# Altium project WR_NIC.PrjPcb (part 5 of 6)

## Sheet 17-FPGA-02b.SchDoc
size B; SheetNumber: 17; SheetTotal: 22
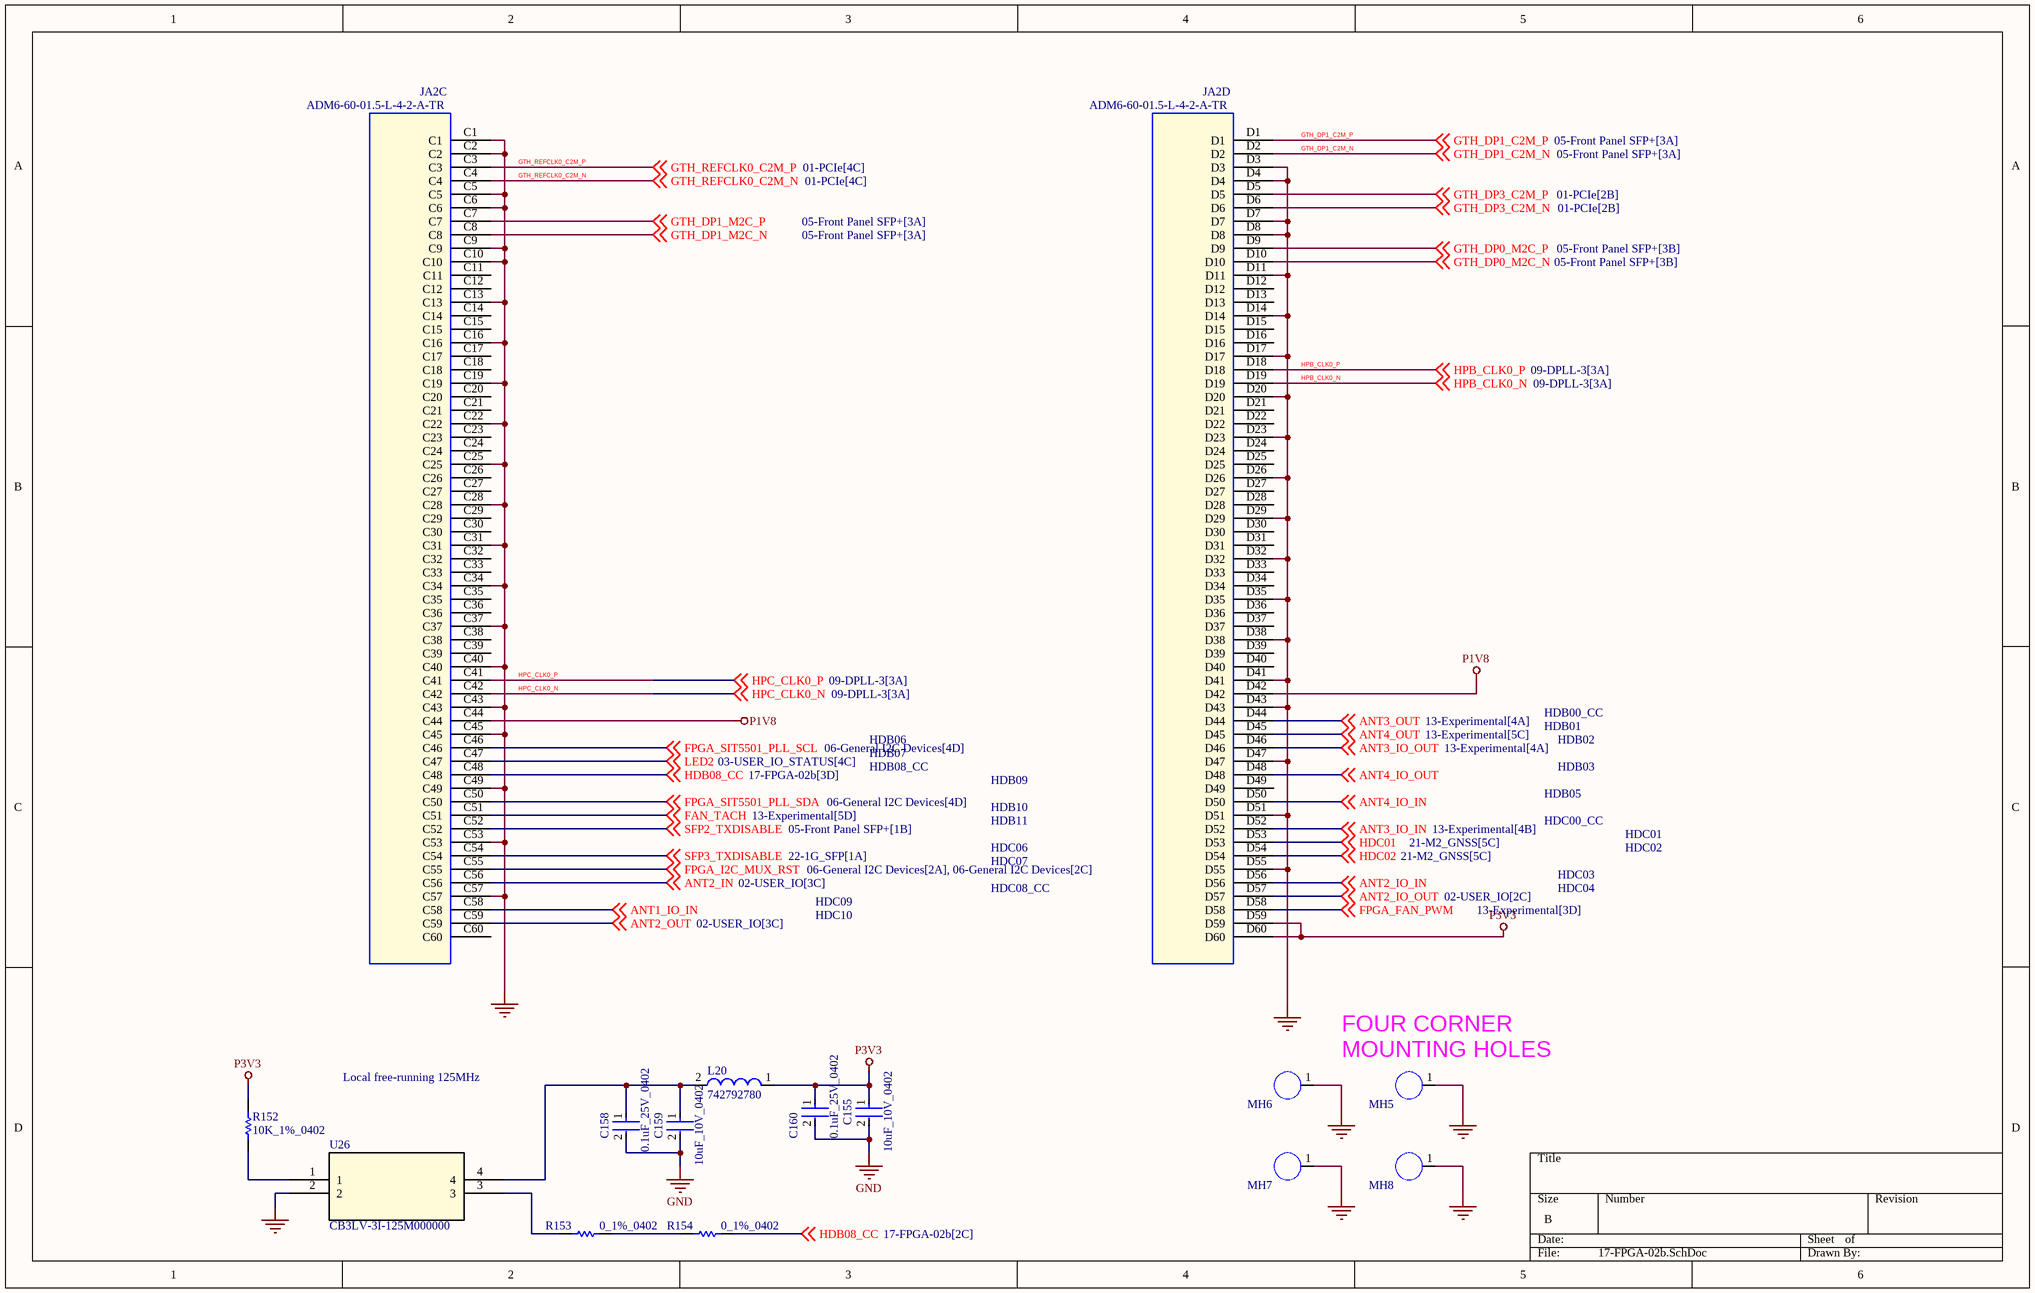
[diagram p17: 17-FPGA-02b.SchDoc]

### Parts
C155  10uF_10V_0402  [FP-CL05A106MP5NUNC-MFG]
C158  0.1uF_25V_0402  [FP-0402-L_1_0_1-W_0_5_0_1-IPC_C]
C159  10uF_10V_0402  [FP-CL05A106MP5NUNC-MFG]
C160  0.1uF_25V_0402  [FP-0402-L_1_0_1-W_0_5_0_1-IPC_C]
JA2  ADM6-60-01.5-L-4-2-A-TR  [CON_SAMTEC_ADM6_60_4]  (parts C,D of 4)
L20  742792780  [SMD-0402]
MH5  MH_NP_M3_SO_600  [MH_NP_M3_SO_600]  (value not drawn)
MH6  MH_NP_M3_SO_600  [MH_NP_M3_SO_600]  (value not drawn)
MH7  MH_NP_M3_SO_600  [MH_NP_M3_SO_600]  (value not drawn)
MH8  MH_NP_M3_SO_600  [MH_NP_M3_SO_600]  (value not drawn)
R152  10K_1%_0402  [RESC1005X40X25LL05T05]
R153  0_1%_0402  [RESC1005X40X25LL05T05]
R154  0_1%_0402  [RESC1005X40X25LL05T05]
U26  CB3LV-3I-125M000000  [CRYS_CB3LV-3I-14M7456_CTS]

### Nets
GND: C155.2 C158.2 C159.2 C160.2 JA2.C1 JA2.C2 JA2.C5 JA2.C6 JA2.C9 JA2.C10 JA2.C13 JA2.C16 JA2.C19 JA2.C22 JA2.C25 JA2.C28 JA2.C31 JA2.C34 JA2.C37 JA2.C40 JA2.C43 JA2.C45 JA2.C49 JA2.C53 JA2.C57 JA2.D3 JA2.D4 JA2.D7 JA2.D8 JA2.D11 JA2.D14 JA2.D17 JA2.D20 JA2.D23 JA2.D26 JA2.D29 JA2.D32 JA2.D35 JA2.D38 JA2.D41 JA2.D43 JA2.D47 JA2.D51 JA2.D55 MH5.1 MH6.1 MH7.1 MH8.1 U26.2
P1V8: JA2.C44 JA2.D42
P3V3: C155.1 C160.1 JA2.D59 JA2.D60 L20.1 R152.2
ANT1_IO_IN: JA2.C58 ; off-sheet ANT1_IO_IN
ANT2_IN: JA2.C56 ; off-sheet ANT2_IN
ANT2_IO_IN: JA2.D56 ; off-sheet ANT2_IO_IN
ANT2_IO_OUT: JA2.D57 ; off-sheet ANT2_IO_OUT
ANT2_OUT: JA2.C59 ; off-sheet ANT2_OUT
ANT3_IO_IN: JA2.D52 ; off-sheet ANT3_IO_IN
ANT3_IO_OUT: JA2.D46 ; off-sheet ANT3_IO_OUT
ANT3_OUT: JA2.D44 ; off-sheet ANT3_OUT
ANT4_IO_IN: JA2.D50 ; off-sheet ANT4_IO_IN
ANT4_IO_OUT: JA2.D48 ; off-sheet ANT4_IO_OUT
ANT4_OUT: JA2.D45 ; off-sheet ANT4_OUT
FAN_TACH: JA2.C51 ; off-sheet FAN_TACH
FPGA_FAN_PWM: JA2.D58 ; off-sheet FPGA_FAN_PWM
FPGA_I2C_MUX_RST: JA2.C55 ; off-sheet FPGA_I2C_MUX_RST
FPGA_SIT5501_PLL_SCL: JA2.C46 ; off-sheet FPGA_SIT5501_PLL_SCL
FPGA_SIT5501_PLL_SDA: JA2.C50 ; off-sheet FPGA_SIT5501_PLL_SDA
GTH_DP0_M2C_N: JA2.D10 ; off-sheet GTH_DP0_M2C_N
GTH_DP0_M2C_P: JA2.D9 ; off-sheet GTH_DP0_M2C_P
GTH_DP1_C2M_N: JA2.D2 ; off-sheet GTH_DP1_C2M_N
GTH_DP1_C2M_P: JA2.D1 ; off-sheet GTH_DP1_C2M_P
GTH_DP1_M2C_N: JA2.C8 ; off-sheet GTH_DP1_M2C_N
GTH_DP1_M2C_P: JA2.C7 ; off-sheet GTH_DP1_M2C_P
GTH_DP3_C2M_N: JA2.D6 ; off-sheet GTH_DP3_C2M_N
GTH_DP3_C2M_P: JA2.D5 ; off-sheet GTH_DP3_C2M_P
GTH_REFCLK0_C2M_N: JA2.C4 ; off-sheet GTH_REFCLK0_C2M_N
GTH_REFCLK0_C2M_P: JA2.C3 ; off-sheet GTH_REFCLK0_C2M_P
HDB08_CC: JA2.C48 R154.2 ; off-sheet HDB08_CC
HDC01: JA2.D53 ; off-sheet HDC01
HDC02: JA2.D54 ; off-sheet HDC02
HPB_CLK0_N: JA2.D19 ; off-sheet HPB_CLK0_N
HPB_CLK0_P: JA2.D18 ; off-sheet HPB_CLK0_P
HPC_CLK0_N: JA2.C42 ; off-sheet HPC_CLK0_N
HPC_CLK0_P: JA2.C41 ; off-sheet HPC_CLK0_P
LED2: JA2.C47 ; off-sheet LED2
SFP2_TXDISABLE: JA2.C52 ; off-sheet SFP2_TXDISABLE
SFP3_TXDISABLE: JA2.C54 ; off-sheet SFP3_TXDISABLE
NetC158_1: C158.1 C159.1 L20.2 U26.4
NetR152_1: R152.1 U26.1
NetR153_1: R153.1 U26.3
NetR153_2: R153.2 R154.1

Not connected (* = marked no-connect by the designer): JA2 C11 C12 C14 C15 C17 C18 C20 C21 C23 C24 C26 C27 C29 C30 C32 C33 C35 C36 C38 C39 C60 D12 D13 D15 D16 D21 D22 D24 D25 D27 D28 D30 D31 D33 D34 D36 D37 D39 D40 D49

### Notes on the sheet
- HDB06
- HDB07
- HDB08_CC
- HDB00_CC
- HDB01
- HDB02
- HDB03
- HDB09
- HDB10
- HDB11
- HDC00_CC
- HDB05
- HDC01
- HDC09
- HDC06
- HDC07
- HDC08_CC
- HDC03
- HDC04
- HDC02
- HDC10
- Local free-running 125MHz
- (near MH5) FOUR CORNER
  MOUNTING HOLES

### Library data of the parts
C155 C159 = CMP-13271-000002-1: CAP CER 10UF 10V X5R 0402; Manufacturer Part Number: CL05A106MP5NUNC; Manufacturer: Samsung; Temperature Coefficient: 15%; Tolerance: 20%; Material: Ceramic; Octopart: https://octopart.com/cl05a106mp5nunc-samsung-22457395; Voltage Rating: 10V; RoHS: TRUE; Value: 10uF; Height: 0.7mm; Digikey Description: CAP CER 10UF 10V X5R 0402; Automotive: No; Package: CL05A106MP5NUNC; Device Class L1: Passive Components; Capacitance: 10uF; Temperature Range High: +85°C; ComponentLink2Description: Datasheet; Device Class L2: Capacitors; Temperature Characteristic: X5R; Temperature: -55°C to +85°C; ComponentLink2URL: http://www.samsungsem.com/kr/support/product-search/mlcc/__icsFiles/afieldfile/2019/05/10/19-CL05A106MP5NUNC.pdf; Device Class L3: Ceramic Capacitors; Category: Cap; Temperature Range Low: -55°C; Ipc Land Pattern Name: CAPC10050X50; Lead Free: Yes
C158 C160 = CMP-2008-02519-2: General Purpose Ceramic Capacitor, 0402, 100nF, 10%, X7R, 15%, 25V; Package Quantity: 1; Capacitance: 100nF; Min Operating Temperature: -55°C; Voltage: 25V; Voltage Rating: 25V; Construction: Flat; Max Operating Temperature: 125°C; Radiation Hardening: No; Depth: 0.5mm; Thickness: 0.022inch; Voltage Rating (DC): 25V; Number of Pins: 2; Lead Free: Lead Free; Series: -; REACH SVHC: No SVHC; Length: 1mm; Dielectric: X7R; RoHS Compliant: Yes; Mount: Surface Mount; Packaging: Tape and Reel; Case/Package: 0402; Case Code (Imperial): 0402; Termination: SMD/SMT; Width: 0.02inch; Case Code (Metric): 1005; Tolerance: 10%
JA2 = SAMTEC-ADx6-60X4: Conn Rcpt Male Vert 240 Pos 4x60 0.635mm P Black SMT; Manufacturer: Samtec Inc.; Agile Part Number: CON-00383-01; SPLIT_INST: TRUE; SWAP_INFO: (S1+S2+S3+S4); Barcode: 40000092; Pitch: 0.025" (0.64mm); Datasheet: http://suddendocs.samtec.com/catalog_english/adf6.pdf; Manufacturer PN: ADM6-60-01.5-L-4-2-A-TR; PCB Footprint: CON_SAMTEC_ADM6_60_4; Part Type: CONNECTOR; Number of Pins: 240; CIP Link: http://xsjbrdwin1/CIP-E/Component/Index/All?pn=40000092
L20 = CMP-0220-00137-1: SMD EMI Suppression Ferrite Bead WE-CBF, Z = 220 Ohm; Impedance: 220 Ohm; PackageVersion: 2009; DatasheetVersion: ver 4, Jul-2009; PackageDescription: Chip Inductor, 2-Leads, Body 1.0 x 0.5 mm; ComponentLink1URL: http://www.we-online.com; ComponentLink1Description: Manufacturer Link; ComponentLink2URL: http://www.we-online.de/katalog/media/pdf/742792780.pdf; PackageReference: SMD-0402; ComponentLink2Description: Datasheet
MH5-MH8 = HOLE: MOUNTING HOLE, NON-PLATED 3.4MM HOLE; EDMVersionID: 490415297; Barcode: 96000044; ASSEMBLY_OPTIONS: DNP; PCB Footprint: MH_NP_M3_SO_600; CIP Link: http://xsjbrdwin1/CIP-E/Component/Index/All?pn=96000044; Part Type: HOLE
R152 = CMP-2000-07588-1: Chip Resistor, 10 KOhm, +/- 1%, 0.1 W, -55 to 155 degC, 0402 (1005 Metric), RoHS, Tape and Reel; Manufacturer: Panasonic; Power Rating: 100mW; Voltage Rating: 50V; Resistance: 10KOhm; Case\/Package: 0402; Temperature Coefficient: 100ppm\/degreesC; RoHSCompliant: True; Lead Free: LeadFree; Package Quantity: 1; Contact Plating: Tin; Length: 1mm; Radiation Hardening: No; REACH SVHC: NoSVHC; Max Operating Temperature: 155degC; Depth: 0.5mm; Case Code (Imperial): 0402; Military Standard: Not; Package Description: 2-Pin Surface Mount Device, Body 1 x 0.5 mm; Termination: SMD/SMT; Case Code (Metric): 1005; Height: 0.35mm; Packaging: TapeandReel; Voltage Rating (DC): 50V; Package Reference: 402; Number of Pins: 2; Tolerance: 1%; Mounting Technology: SurfaceMount; Width: 0.02inch; Mount: SurfaceMount; Datasheet URL: https://industrial.panasonic.com/cdbs/www-data/pdf/RDA0000/AOA0000C304.pdf; Composition: ThickFilm; Datasheet Version: 02/2017; Manufacturer URL: http://www.panasonic.com/; Max Power Dissipation: 100mW; Number of Terminations: 2; Min Operating Temperature: -55degC
R153 R154 = CMP-2000-07451-1: Chip Resistor, 0 Ohm, 0.1 W, -55 to 155 degC, 0402 (1005 Metric), RoHS, Tape and Reel; Manufacturer: Panasonic; Voltage Rating (DC): 50V; Temperature Coefficient: 600ppm/��C; Max Power Dissipation: 100mW; Resistance: 0mOhm; Tolerance: 5%; Number of Terminations: 2; Mount: SurfaceMount; Height: 0.35mm; Packaging: TapeandReel; Contact Plating: Tin; Manufacturer URL: http://www.panasonic.com/; Composition: ThickFilm; Max Operating Temperature: 155degC; REACH SVHC: NoSVHC; Case/Package: 0402; Package Reference: 402; Depth: 0.5mm; Package Description: 2-Pin Surface Mount Device, Body 1 x 0.5 mm; Datasheet URL: https://industrial.panasonic.com/cdbs/www-data/pdf/RDA0000/AOA0000C301.pdf; RoHSCompliant: True; Case Code (Imperial): 0402; Military Standard: Not; Min Operating Temperature: -55degC; Power Rating: 100mW; Datasheet Version: 03/2015; Length: 1mm; Case Code (Metric): 1005; Termination: SMD/SMT; Mounting Technology: SurfaceMount; Voltage Rating: 50V; Width: 0.02inch; Package Quantity: 1; Lead Free: LeadFree; Radiation Hardening: No
U26 = CB3LV-3I-14M7456: No Description Available; Mfr_Name: CTS Components; RefDes: RefDes; Type: Type; Supplier 1: Avnet; Supplier Part Number 1: CB3LV-3I-125M00000

## Sheet 18-Power-P3V3.SchDoc
size B; SheetNumber: 18; SheetTotal: 22; SPICEModelCacheMBQUAUON: <root> / <DocumentId>MBQUAUON</DocumentId> / <CacheFrame Number="0"> / <Model Name="emk105bj105_v-f" Kind="CKT"> / <Text>* EMK105BJ105_V-F     SPICE MODEL  ( General Type ) / *-------------------------------------------------------------------------------------------------------- / * Model Generated by TAIYO YUDEN Corporation (http://www.ty-top.com) / * Version 1.0 / * TAIYO YUDEN Control No. 170508_130520 / * Copyright(c) 2012 TAIYO YUDEN CO.,LTD. All Rights Reserved. / *-------------------------------------------------------------------------------------------------------- / * / * Products Name : Multilayer Ceramic Capacitors / * / * Characteristics : / *     Capacitance : 1 uF , Rated Voltage : 16V , TCC : X5R / *     Case Size : 1.0 x 0.5 / 0.039 x 0.02 [mm/inch] , Thickness : 0.5 / 0.02 [mm/inch] / *     (Conditions: Temperature = 25 degC , DC Bias Current/Voltage = 0A / 0V) / * / * Frequency Range : 40Hz - 3GHz / * / * External Node Assignments : / * / *  1  o---| |---o  2 / * / *-------------------------------------------------------------------------------------------------------- / .SubCkt EMK105BJ105_V-F 1 2 / **************************** / C0 1 110 0.68309u / Cm 1 101 0.26053u / C1 101 102 0.94076u / Rc1 101 102 1.9029k / C2 102 103 0.66707u / Rc2 102 103 120.36 / C3 103 110 0.57203u / Rc3 103 110 2.1097 / C2m 1 301 0.1871u / C21 301 302 3.2494u / Rc21 301 302 1.1117k / C22 302 303 2.1014u / Rc22 302 303 1.484k / C23 303 304 2.1172u / Rc23 303 304 1.3876k / C24 304 305 0.75729u / Rc24 304 305 332.59 / C25 305 306 0.94401u / Rc25 305 306 249.09 / C26 306 307 0.34674u / Rc26 306 307 28.352 / C27 307 308 0.37158u / Rc27 307 308 19.989 / C28 308 309 0.17933u / Rc28 308 309 31.748 / C29 309 110 0.016445u / Rc29 309 110 1.0592 / Rp0 1 110 100Meg / L0 110 120 0.2216n / Lm 120 130 0.1509n / L1 120 121 0.12659n / RL1 121 130 0.85161 / L2 120 122 0.15996n / RL2 122 130 0.42469 / L3 120 123 7.9543n / RL3 123 130 0.54643m / CR 120 124 0.24334u / LR 124 125 0.090738n / RR 125 130 68.076m / CL 130 140 2.7354p / LL 130 140 0.10762n / RL 130 140 50.614 / Rs 140 2 7.5416m / **************************** / .ends EMK105BJ105_V-F</Text> / </Model> / </CacheFrame> / </root>
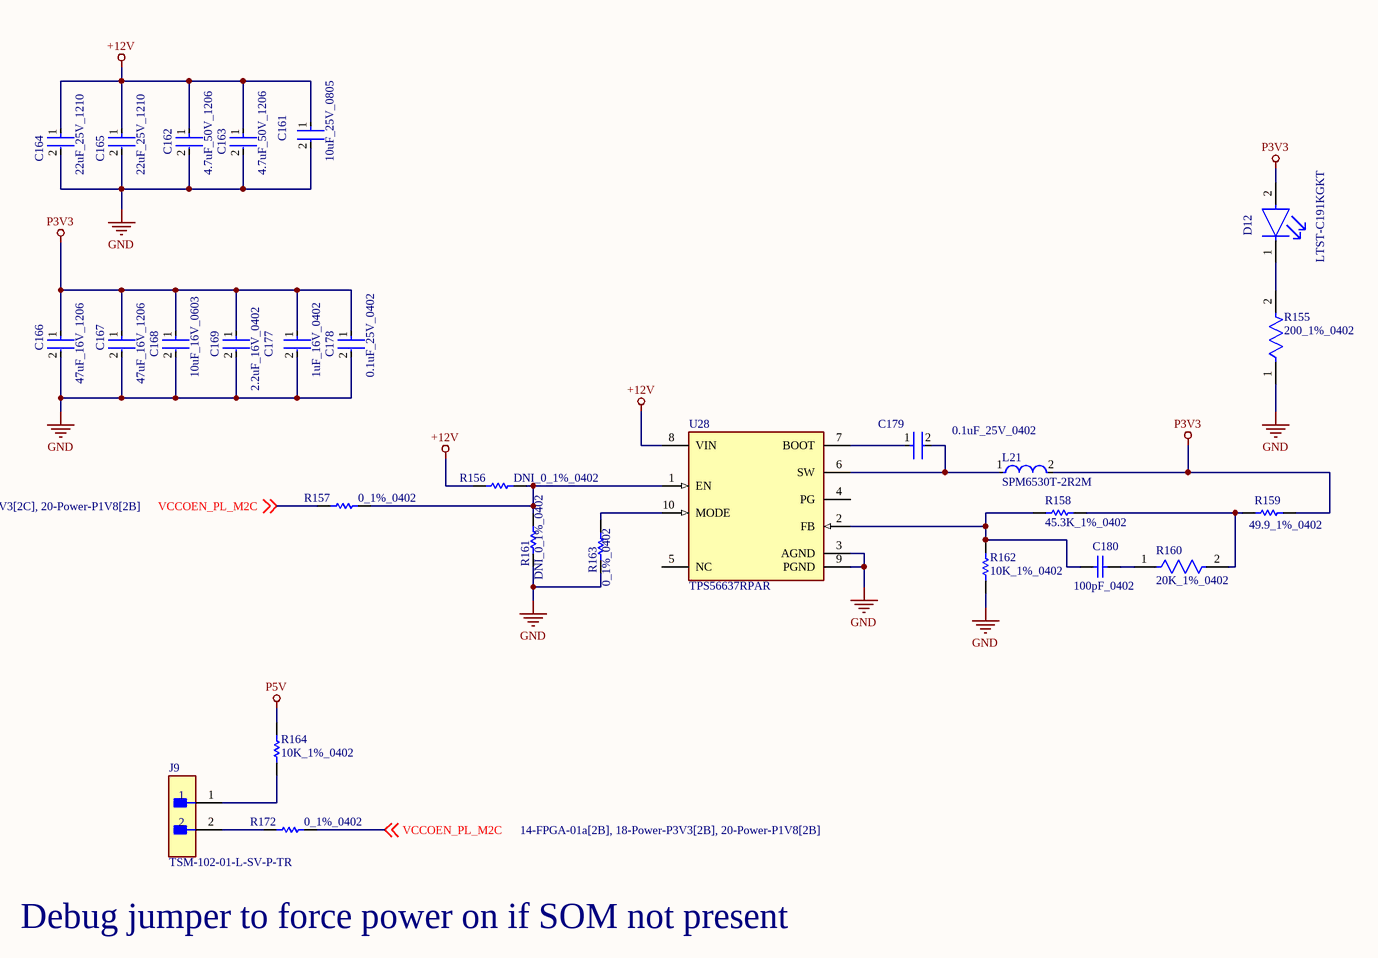
[diagram p18: 18-Power-P3V3.SchDoc]

### Parts
C161  10uF_25V_0805  [FP-0805-L_2_0_0_2-W_1_25-MFG]
C162  4.7uF_50V_1206  [FP-GRM31C-0_2-e0_3_0_8-IPC_C]
C163  4.7uF_50V_1206  [FP-GRM31C-0_2-e0_3_0_8-IPC_C]
C164  22uF_25V_1210  [FP-MK325M-MFG]
C165  22uF_25V_1210  [FP-MK325M-MFG]
C166  47uF_16V_1206  [FP-C3216-160-0_2-MFG]
C167  47uF_16V_1206  [FP-C3216-160-0_2-MFG]
C168  10uF_16V_0603  [FP-0603-L_1_6_0_2-W_0_8_0-MFG]
C169  2.2uF_16V_0402  [FP-C1005-050-0_05-IPC_A]
C177  1uF_16V_0402  [FP-0402-L_1_0_0_05-W_0_5-IPC_A]
C178  0.1uF_25V_0402  [FP-0402-L_1_0_1-W_0_5_0_1-IPC_C]
C179  0.1uF_25V_0402  [FP-0402-L_1_0_1-W_0_5_0_1-IPC_C]
C180  100pF_0402  [CAPC1005X55X25ML05T10]
D12  LTST-C191KGKT  [FP-LTST-C191KGKT-MFG]
J9  TSM-102-01-L-SV-P-TR  [FP-TSM-102-01-L-SV-P-TR-MFG]
L21  SPM6530T-2R2M  [FP-SPM6530-MFG]
R155  200_1%_0402  [FP-ERJ2RK-IPC_A]
R156  DNI_0_1%_0402  [RESC1005X40X25LL05T05]  (no BOM)
R157  0_1%_0402  [RESC1005X40X25LL05T05]
R158  45.3K_1%_0402  [RESC1005X40X25ML05T05]
R159  49.9_1%_0402  [RESC1005X40X25LL05T10]
R160  20K_1%_0402  [FP-ERJ2RK-MFG]
R161  DNI_0_1%_0402  [RESC1005X40X25LL05T05]  (no BOM)
R162  10K_1%_0402  [RESC1005X40X25LL05T05]
R163  0_1%_0402  [RESC1005X40X25LL05T05]
R164  10K_1%_0402  [RESC1005X40X25LL05T05]
R172  0_1%_0402  [RESC1005X40X25LL05T05]
U28  TPS56637RPAR  [FP-RPA0010A-MFG]

### Nets
+12V: C161.1 C162.1 C163.1 C164.1 C165.1 R156.1 U28.8(VIN)
GND: C161.2 C162.2 C163.2 C164.2 C165.2 C166.2 C167.2 C168.2 C169.2 C177.2 C178.2 R155.1 R161.1 R162.1 R163.1 U28.3(AGND) U28.9(PGND)
P3V3: C166.1 C167.1 C168.1 C169.1 C177.1 C178.1 D12.2(A) L21.2 R159.2
P5V: R164.2
VCCOEN_PL_M2C: R157.1 R172.2 ; off-sheet VCCOEN_PL_M2C
NetC179_1: C179.1 U28.7(BOOT)
NetC179_2: C179.2 L21.1 U28.6(SW)
NetC180_1: C180.1 R158.1 R162.2 U28.2(FB)
NetC180_2: C180.2 R160.1
NetD12_1: D12.1(C) R155.2
NetJ9_1: J9.1 R164.1
NetJ9_2: J9.2 R172.1
NetR156_2: R156.2 R157.2 R161.2 U28.1(EN)
NetR158_2: R158.2 R159.1 R160.2
NetR163_2: R163.2 U28.10(MODE)

Not connected (* = marked no-connect by the designer): U28 4(PG) 5(NC)

### Notes on the sheet
- Debug jumper to force power on if SOM not present

### Library data of the parts
C161 = CMP-14477-000079-3: Multilayer Ceramic Capacitor 10uF 25V X5R 10% SMD 0805 T/R; Voltage: 16V; Dielectric: X7R; Number of Pins: 2; Width: 0.049inch; REACH SVHC: No SVHC; Packaging: Tape and Reel; Max Operating Temperature: 85°C; Length: 0.079inch; Termination: SMD/SMT; RoHS Compliant: Yes; Thickness: 0.053inch; Case/Package: 0805; Case Code (Imperial): 0805; Capacitance: 10uF; Lead Free: Lead Free; Voltage Rating: 25V; Resistor Type: Ceramic; Voltage Rating (DC): 25V; Case Code (Metric): 2012; Mount: Surface Mount; Package Quantity: 1; Height: 1.25mm; Series: M; Tolerance: 10%; Min Operating Temperature: -55°C
C162 C163 = CMP-1037-04923-3: Chip Multilayer Ceramic Capacitors for General Purpose, 1206, 4.7uF, X7R, 15%, 10%, 50V; Height: 1.6mm; Voltage: 50V; Capacitance: 4.7uF; Lead Free: Lead Free; Max Operating Temperature: 125°C; Packaging: Tape and Reel; REACH SVHC: No SVHC; Voltage Rating: 50V; Mount: Surface Mount; Termination: SMD/SMT; Tolerance: 10%; Case/Package: 1206; Material: Ceramic; Depth: 1.6mm; Length: 3.2mm; Case Code (Metric): 3216; Voltage Rating (DC): 50V; Case Code (Imperial): 1206; Radiation Hardening: No; Width: 0.063inch; Thickness: 0.071inch; Package Quantity: 2000; Min Operating Temperature: -55°C; Dielectric: X7R
C164 C165 = CMP-14477-000145-1: CAP CER 22UF 25V X5R 1210; Tolerance: 20%; Width: 0.098inch; Thickness: 0.106inch; Depth: 2.5mm; Packaging: Tape and Reel; Max Operating Temperature: 85°C; Termination: SMD/SMT; Case Code (Imperial): 1210; Height: 2.5mm; Case/Package: 1210; Voltage Rating: 25V; Package Quantity: 1; Min Operating Temperature: -55°C; Capacitance: 22uF; Halogen Free: Halogen Free; Case Code (Metric): 3225; Mount: Surface Mount; Construction: Flat; Radiation Hardening: No; Length: 3.2mm; Voltage Rating (DC): 25V; Contact Plating: Nickel; Number of Pins: 2; Dielectric: X5R; RoHS Compliant: Yes; Resistor Type: Ceramic; Series: M
C166 C167 = CMP-2000-07442-2: Multilayer Ceramic Capacitors 47uF ±20% 16V X5R SMD 1206; Resistor Type: Ceramic; Width: 0.063inch; Case Code (Imperial): 1206; Radiation Hardening: No; Thickness: 0.071inch; Dielectric: X5R; Weight: 0.000571oz; Termination: SMD/SMT; Dielectric Material: Ceramic; Min Operating Temperature: -55°C; Depth: 1.6mm; Case Code (Metric): 3216; Max Operating Temperature: 85°C; RoHS Compliant: Yes; REACH SVHC: No SVHC; Mount: Surface Mount; Lead Free: Lead Free; Height: 1.6mm; Length: 3.2mm; Tolerance: 20%; Voltage Rating (DC): 16V; Capacitance: 47uF; Package Quantity: 1; Construction: Flat; Packaging: Tape and Reel; Series: C; Case/Package: 1206; Voltage Rating: 16V
C168 = CMP-2000-06226-4: Multilayer Ceramic Capacitor 10uF 16V X5R 20% SMD 0603 T/R; Packaging: Tape and Reel; Construction: Flat; Height: 0.8mm; Max Operating Temperature: 85°C; Dielectric: X5R; Case Code (Metric): 1608; Voltage Rating (DC): 16V; Width: 0.031inch; Voltage Rating: 16V; Length: 0.063inch; RoHS Compliant: Yes; Halogen Free: Halogen Free; Case Code (Imperial): 0603; Capacitance: 10uF; Mount: Surface Mount; Thickness: 0.031inch; Tolerance: 20%; Min Operating Temperature: -55°C; Series: M; Termination: SMD/SMT; Case/Package: 0603; Package Quantity: 1
C169 = CMP-2000-05998-2: Multilayer Ceramic Capacitors 2.2μF ±10% 16V X5R SMD 0402; Capacitance: 2.2uF; REACH SVHC: No SVHC; Series: C; Termination: SMD/SMT; Case Code (Imperial): 0402; Depth: 0.5mm; Mount: Surface Mount; Width: 0.02inch; Package Quantity: 1; Dielectric Material: Ceramic; Length: 1mm; Packaging: Tape and Reel; Case Code (Metric): 1005; RoHS Compliant: Yes; Dielectric: X5R; Max Operating Temperature: 85°C; Lead Free: Lead Free; Weight: 2.3E-05oz; Thickness: 0.022inch; Voltage Rating (DC): 16V; Tolerance: 10%; Voltage Rating: 16V; Resistor Type: Ceramic; Height: 0.5mm; Case/Package: 0402; Min Operating Temperature: -55°C
C177 = CMP-14477-000104-2: None; Tolerance: 10%; Voltage Rating: 16V; Dielectric: X5R; Capacitance: 1uF; Packaging: Tape and Reel; Depth: 0.5mm; Mount: Surface Mount; Thickness: 0.022inch; Package Quantity: 1; Min Operating Temperature: -55°C; Series: M; Voltage Rating (DC): 16V; Termination: SMD/SMT; Case/Package: 0402; Number of Pins: 2; Case Code (Imperial): 0402; Length: 1mm; Halogen Free: Halogen Free; Case Code (Metric): 1005; Width: 0.02inch; RoHS Compliant: Yes; Radiation Hardening: No; Max Operating Temperature: 85°C; Height: 0.5mm; Construction: Flat
C178 C179 = CMP-2008-02519-2: as C158 on sheet 17-FPGA-02b; Package Quantity: 1; Capacitance: 100nF; Min Operating Temperature: -55°C; Voltage: 25V; Voltage Rating: 25V; Construction: Flat; Max Operating Temperature: 125°C; Radiation Hardening: No; Depth: 0.5mm; Thickness: 0.022inch; Voltage Rating (DC): 25V; Number of Pins: 2; Lead Free: Lead Free; Series: -; REACH SVHC: No SVHC; Length: 1mm; Dielectric: X7R; RoHS Compliant: Yes; Mount: Surface Mount; Packaging: Tape and Reel; Case/Package: 0402; Case Code (Imperial): 0402; Termination: SMD/SMT; Width: 0.02inch; Case Code (Metric): 1005; Tolerance: 10%
C180 = CMP-2008-03915-1: Manufacturer: Murata; Part Number: GRM1555C1H101JA01D
D12 = CMP-2000-05198-2: LED GREEN CLEAR SMD; Max Power Dissipation: 75mW; Forward Current: 30mA; Reverse Voltage: 5V; Lens Color: Colorless; Forward Voltage: 2V; Dominant Wavelength: 571nm; Number of LEDs: 1; Viewing Angle: 130°; Lens Style: Rectangular; Test Current: 20mA; Luminous Intensity: 35mcd; Wavelength: 574nm; Width: 0.8mm; Case Code (Imperial): 0603; Number of Pins: 2; Lead Free: Lead Free; Packaging: Tape and Reel; Package Quantity: 1; Min Operating Temperature: -55°C; Case/Package: 0603; Length: 1.6mm; Power Dissipation: 75mW; Depth: 0.8mm; Radiation Hardening: No; Mount: Surface Mount; Max Operating Temperature: 85°C; Color: Green; Power Rating: 75mW; Height: 0.55mm; Illumination Color: Green; Case Code (Metric): 1608; Lens Transparency: Clear; Number of Elements: 1
J9 = CMP-02766-001438-1: CONN HEADER SMD 2POS 2.54MM; Max Voltage Rating (AC): 475V; Max Current Rating: 7A; Gender: Male; Number of Contacts: 2; REACH SVHC: No SVHC; Max Operating Temperature: 125°C; Contact Material: Bronze; Orientation: Straight; Contact Plating: Gold; Lead Free: Lead Free; RoHS Compliant: Yes; Length: 5.08mm; Housing Material: Polymer; Number of Rows: 1; Pitch: 2.54mm; Termination: Solder; Housing Color: Black; Radiation Hardening: No; Packaging: Tape and Reel; Min Operating Temperature: -55°C; Depth: 2.54mm
L21 = CMP-08253-000021-1: FIXED IND 2.2UH 8.2A 19 MOHM SMD; Manufacturer: TDK; Test Frequency: 100kHz; Shielding: true; Standoff Height: 0.15mm; Core Material: Metal; Saturation Current: 8.4A; Tolerance: 20%; Series Resistance: 19.1mΩ; Automotive: No; Octopart: https://octopart.com/spm6530t-2r2m-tdk-18903909; Mouser Description: Fixed Inductors 2.2uH 0.0173ohms 7.1x6.5x3mm; ComponentLink2URL: https://product.tdk.com/info/en/catalog/datasheets/inductor_commercial_power_spm6530_en.pdf; Height: 3mm; Device Class L2: Inductors; Package: SPM6530; Rms Current: 8.2A; ComponentLink2Description: Datasheet; RoHS: TRUE; Temperature Range Low: -40°C; Digikey Description: FIXED IND 2.2UH 8.2A 19 MOHM SMD; Device Class L1: Passive Components; Device Class L3: Fixed Inductors; Value: 2.2uH; Temperature Range High: +125°C; Inductance: 2.2uH; Temperature: -40°C to +125°C; Lead Free: Yes; Manufacturer Part Number: SPM6530T-2R2M; Composition: Wirewound; Category: Ind
R155 = CMP-2002-00757-2: RES SMD 200 OHM 1% 1/10W 0402; Power Rating: 100mW; Voltage Rating (DC): 50V; Resistance: 200R; Temperature Coefficient: 100ppm/°C; RoHS Compliant: Yes; Packaging: Tape and Reel; Case Code (Metric): 1005; Package Quantity: 1; Contact Plating: Tin; Series: ERJ; Mount: Surface Mount; Lead Free: Lead Free; Min Operating Temperature: -55°C; Number of Terminations: 2; Max Power Dissipation: 100mW; Technology: THICK FILM; Voltage Rating: 50V; Case/Package: 0402; Width: 0.02inch; Termination: SMD/SMT; Military Standard: Not; Height: 0.35mm; Radiation Hardening: No; Resistance Tolerance: 1%; Length: 1mm; REACH SVHC: No SVHC; Construction: Rectangular; Depth: 0.5mm; Features: Automotive AEC-Q200; Resistor Type: Thick Film; Case Code (Imperial): 0402; Tolerance: 1%; Size Code: 0402; Max Operating Temperature: 155°C
R156 R157 R161 R163 R172 = CMP-2000-07451-1: as R153 on sheet 17-FPGA-02b; Number of Terminations: 2; Mount: SurfaceMount; Height: 0.35mm; Packaging: TapeandReel; Contact Plating: Tin; Manufacturer URL: http://www.panasonic.com/; Composition: ThickFilm; Max Operating Temperature: 155degC; REACH SVHC: NoSVHC; Case/Package: 0402; Package Reference: 402; Depth: 0.5mm; Package Description: 2-Pin Surface Mount Device, Body 1 x 0.5 mm; Datasheet URL: https://industrial.panasonic.com/cdbs/www-data/pdf/RDA0000/AOA0000C301.pdf; RoHSCompliant: True; Case Code (Imperial): 0402; Military Standard: Not; Min Operating Temperature: -55degC; Power Rating: 100mW; Datasheet Version: 03/2015; Length: 1mm; Case Code (Metric): 1005; Termination: SMD/SMT; Mounting Technology: SurfaceMount; Voltage Rating: 50V; Width: 0.02inch; Package Quantity: 1; Lead Free: LeadFree; Radiation Hardening: No
R158 = CMP-2002-00947-1: Part Number: ERJ-2RKF4532X; Manufacturer: Panasonic
R159 = CMP-2002-07709-1: Manufacturer: Yageo / Phycomp; Part Number: RC0402FR-0749R9L
R160 = CMP-2002-00759-4: RES SMD 20K OHM 1% 1/10W 0402; Resistance: 20kR; Voltage Rating (DC): 50V; Power Rating: 100mW; Temperature Coefficient: 100ppm/°C; Radiation Hardening: No; Case/Package: 0402; Case Code (Metric): 1005; Min Operating Temperature: -55°C; Termination: SMD/SMT; Package Quantity: 1; Length: 1mm; Case Code (Imperial): 0402; Lead Free: Lead Free; Height: 0.35mm; Max Operating Temperature: 155°C; Depth: 0.5mm; Number of Terminations: 2; Military Standard: Not; Max Power Dissipation: 100mW; Tolerance: 1%; Composition: Thick Film; Weight: 2.8E-05oz; Features: Automotive AEC-Q200; Voltage Rating: 50V; Contact Plating: Tin; REACH SVHC: No SVHC; Width: 0.02inch; Packaging: Cut Tape; Mount: Surface Mount
R162 R164 = CMP-2000-07588-1: as R152 on sheet 17-FPGA-02b; RoHSCompliant: True; Lead Free: LeadFree; Package Quantity: 1; Contact Plating: Tin; Length: 1mm; Radiation Hardening: No; REACH SVHC: NoSVHC; Max Operating Temperature: 155degC; Depth: 0.5mm; Case Code (Imperial): 0402; Military Standard: Not; Package Description: 2-Pin Surface Mount Device, Body 1 x 0.5 mm; Termination: SMD/SMT; Case Code (Metric): 1005; Height: 0.35mm; Packaging: TapeandReel; Voltage Rating (DC): 50V; Package Reference: 402; Number of Pins: 2; Tolerance: 1%; Mounting Technology: SurfaceMount; Width: 0.02inch; Mount: SurfaceMount; Datasheet URL: https://industrial.panasonic.com/cdbs/www-data/pdf/RDA0000/AOA0000C304.pdf; Composition: ThickFilm; Datasheet Version: 02/2017; Manufacturer URL: http://www.panasonic.com/; Max Power Dissipation: 100mW; Number of Terminations: 2; Min Operating Temperature: -55degC
U28 = CMP-04918-000008-1: IC POWER MANAGEMENT; Manufacturer: Texas Instruments; Max Duty Cycle: 91%; Nominal Supply Current: 140uA; Max Supply Voltage: 28V; Output Current: 6A; Switching Frequency: 500kHz; Output Type: AdjustableProgrammable; Max Junction Temp: +150°C; Output Voltage: 0.6-13V; Switching Topology: Buck; Standoff Height: 0mm; Number Of Outputs: 1; Min Supply Voltage: 4.5V; Automotive: No; Manufacturer Part Number: TPS56637RPAR; Lead Free: Yes; Temperature Range Low: -40°C; Digikey Description: IC POWER MANAGEMENT; Octopart: https://octopart.com/tps56637rpar-texas+instruments-97650653; Temperature: -40°C to +150°C; Device Class L3: Voltage Regulators - Switching; Temperature Range High: +150°C; Package: RPA0010A; Device Class L2: Power Management ICs; ComponentLink2URL: http://www.ti.com/lit/ds/symlink/tps56637.pdf; Device Class L1: Integrated Circuits (ICs); RoHS: TRUE; ComponentLink2Description: Datasheet; Height: 1mm; Category: IC

## Sheet 19-Power-P5V.SchDoc
size B; SheetNumber: 19; SheetTotal: 22; SPICEModelCacheMWNZRPGN: <root> / <DocumentId>MWNZRPGN</DocumentId> / <CacheFrame Number="0"> / <Model Name="emk105bj105_v-f" Kind="CKT"> / <Text>* EMK105BJ105_V-F     SPICE MODEL  ( General Type ) / *-------------------------------------------------------------------------------------------------------- / * Model Generated by TAIYO YUDEN Corporation (http://www.ty-top.com) / * Version 1.0 / * TAIYO YUDEN Control No. 170508_130520 / * Copyright(c) 2012 TAIYO YUDEN CO.,LTD. All Rights Reserved. / *-------------------------------------------------------------------------------------------------------- / * / * Products Name : Multilayer Ceramic Capacitors / * / * Characteristics : / *     Capacitance : 1 uF , Rated Voltage : 16V , TCC : X5R / *     Case Size : 1.0 x 0.5 / 0.039 x 0.02 [mm/inch] , Thickness : 0.5 / 0.02 [mm/inch] / *     (Conditions: Temperature = 25 degC , DC Bias Current/Voltage = 0A / 0V) / * / * Frequency Range : 40Hz - 3GHz / * / * External Node Assignments : / * / *  1  o---| |---o  2 / * / *-------------------------------------------------------------------------------------------------------- / .SubCkt EMK105BJ105_V-F 1 2 / **************************** / C0 1 110 0.68309u / Cm 1 101 0.26053u / C1 101 102 0.94076u / Rc1 101 102 1.9029k / C2 102 103 0.66707u / Rc2 102 103 120.36 / C3 103 110 0.57203u / Rc3 103 110 2.1097 / C2m 1 301 0.1871u / C21 301 302 3.2494u / Rc21 301 302 1.1117k / C22 302 303 2.1014u / Rc22 302 303 1.484k / C23 303 304 2.1172u / Rc23 303 304 1.3876k / C24 304 305 0.75729u / Rc24 304 305 332.59 / C25 305 306 0.94401u / Rc25 305 306 249.09 / C26 306 307 0.34674u / Rc26 306 307 28.352 / C27 307 308 0.37158u / Rc27 307 308 19.989 / C28 308 309 0.17933u / Rc28 308 309 31.748 / C29 309 110 0.016445u / Rc29 309 110 1.0592 / Rp0 1 110 100Meg / L0 110 120 0.2216n / Lm 120 130 0.1509n / L1 120 121 0.12659n / RL1 121 130 0.85161 / L2 120 122 0.15996n / RL2 122 130 0.42469 / L3 120 123 7.9543n / RL3 123 130 0.54643m / CR 120 124 0.24334u / LR 124 125 0.090738n / RR 125 130 68.076m / CL 130 140 2.7354p / LL 130 140 0.10762n / RL 130 140 50.614 / Rs 140 2 7.5416m / **************************** / .ends EMK105BJ105_V-F</Text> / </Model> / </CacheFrame> / </root>
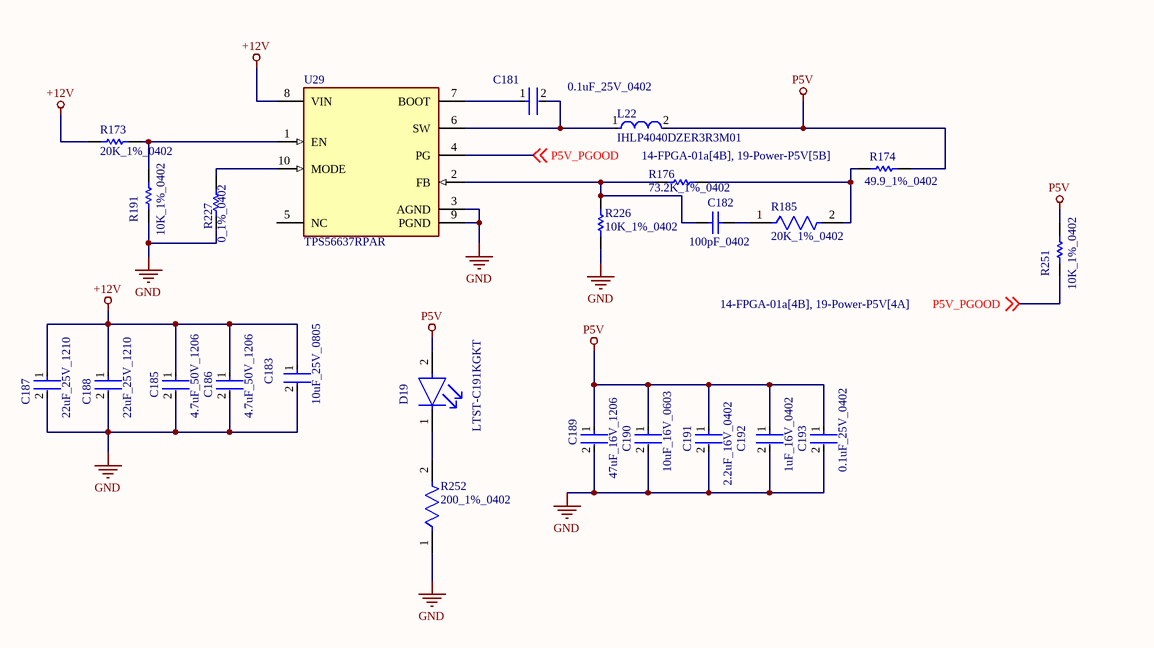
[diagram p19: 19-Power-P5V.SchDoc]

### Parts
C181  0.1uF_25V_0402  [FP-0402-L_1_0_1-W_0_5_0_1-IPC_C]
C182  100pF_0402  [CAPC1005X55X25ML05T10]
C183  10uF_25V_0805  [FP-0805-L_2_0_0_2-W_1_25-MFG]
C185  4.7uF_50V_1206  [FP-GRM31C-0_2-e0_3_0_8-IPC_C]
C186  4.7uF_50V_1206  [FP-GRM31C-0_2-e0_3_0_8-IPC_C]
C187  22uF_25V_1210  [FP-MK325M-MFG]
C188  22uF_25V_1210  [FP-MK325M-MFG]
C189  47uF_16V_1206  [FP-C3216-160-0_2-MFG]
C190  10uF_16V_0603  [FP-0603-L_1_6_0_2-W_0_8_0-MFG]
C191  2.2uF_16V_0402  [FP-C1005-050-0_05-IPC_A]
C192  1uF_16V_0402  [FP-0402-L_1_0_0_05-W_0_5-IPC_A]
C193  0.1uF_25V_0402  [FP-0402-L_1_0_1-W_0_5_0_1-IPC_C]
D19  LTST-C191KGKT  [FP-LTST-C191KGKT-MFG]
L22  IHLP4040DZER3R3M01  [FP-IHLP-4040DZ-FP_3_124x3-MFG]
R173  20K_1%_0402  [RESC1005X40X25NL10T10]
R174  49.9_1%_0402  [RESC1005X40X25LL05T10]
R176  73.2K_1%_0402  [RESC1005X40X25LL05T05]
R185  20K_1%_0402  [FP-ERJ2RK-MFG]
R191  10K_1%_0402  [RESC1005X40X25LL05T05]
R226  10K_1%_0402  [RESC1005X40X25LL05T05]
R227  0_1%_0402  [RESC1005X40X25LL05T05]
R251  10K_1%_0402  [RESC1005X40X25LL05T05]
R252  200_1%_0402  [FP-ERJ2RK-IPC_A]
U29  TPS56637RPAR  [FP-RPA0010A-MFG]

### Nets
+12V: C183.1 C185.1 C186.1 C187.1 C188.1 R173.1 U29.8(VIN)
GND: C183.2 C185.2 C186.2 C187.2 C188.2 C189.2 C190.2 C191.2 C192.2 C193.2 R191.1 R226.1 R227.1 R252.1 U29.3(AGND) U29.9(PGND)
P5V: C189.1 C190.1 C191.1 C192.1 C193.1 D19.2(A) L22.2 R174.2 R251.2
P5V_PGOOD: R251.1 U29.4(PG) ; off-sheet P5V_PGOOD
NetC181_1: C181.1 U29.7(BOOT)
NetC181_2: C181.2 L22.1 U29.6(SW)
NetC182_1: C182.1 R176.1 R226.2 U29.2(FB)
NetC182_2: C182.2 R185.1
NetD19_1: D19.1(C) R252.2
NetR173_2: R173.2 R191.2 U29.1(EN)
NetR174_1: R174.1 R176.2 R185.2
NetR227_2: R227.2 U29.10(MODE)

Not connected (* = marked no-connect by the designer): U29 5(NC)

### Library data of the parts
C181 C193 = CMP-2008-02519-2: as C158 on sheet 17-FPGA-02b; Package Quantity: 1; Capacitance: 100nF; Min Operating Temperature: -55°C; Voltage: 25V; Voltage Rating: 25V; Construction: Flat; Max Operating Temperature: 125°C; Radiation Hardening: No; Depth: 0.5mm; Thickness: 0.022inch; Voltage Rating (DC): 25V; Number of Pins: 2; Lead Free: Lead Free; Series: -; REACH SVHC: No SVHC; Length: 1mm; Dielectric: X7R; RoHS Compliant: Yes; Mount: Surface Mount; Packaging: Tape and Reel; Case/Package: 0402; Case Code (Imperial): 0402; Termination: SMD/SMT; Width: 0.02inch; Case Code (Metric): 1005; Tolerance: 10%
C182 = CMP-2008-03915-1: as C180 on sheet 18-Power-P3V3
C183 = CMP-14477-000079-3: as C161 on sheet 18-Power-P3V3; Number of Pins: 2; Width: 0.049inch; REACH SVHC: No SVHC; Packaging: Tape and Reel; Max Operating Temperature: 85°C; Length: 0.079inch; Termination: SMD/SMT; RoHS Compliant: Yes; Thickness: 0.053inch; Case/Package: 0805; Case Code (Imperial): 0805; Capacitance: 10uF; Lead Free: Lead Free; Voltage Rating: 25V; Resistor Type: Ceramic; Voltage Rating (DC): 25V; Case Code (Metric): 2012; Mount: Surface Mount; Package Quantity: 1; Height: 1.25mm; Series: M; Tolerance: 10%; Min Operating Temperature: -55°C
C185 C186 = CMP-1037-04923-3: as C162 on sheet 18-Power-P3V3; Height: 1.6mm; Voltage: 50V; Capacitance: 4.7uF; Lead Free: Lead Free; Max Operating Temperature: 125°C; Packaging: Tape and Reel; REACH SVHC: No SVHC; Voltage Rating: 50V; Mount: Surface Mount; Termination: SMD/SMT; Tolerance: 10%; Case/Package: 1206; Material: Ceramic; Depth: 1.6mm; Length: 3.2mm; Case Code (Metric): 3216; Voltage Rating (DC): 50V; Case Code (Imperial): 1206; Radiation Hardening: No; Width: 0.063inch; Thickness: 0.071inch; Package Quantity: 2000; Min Operating Temperature: -55°C; Dielectric: X7R
C187 C188 = CMP-14477-000145-1: as C164 on sheet 18-Power-P3V3; Width: 0.098inch; Thickness: 0.106inch; Depth: 2.5mm; Packaging: Tape and Reel; Max Operating Temperature: 85°C; Termination: SMD/SMT; Case Code (Imperial): 1210; Height: 2.5mm; Case/Package: 1210; Voltage Rating: 25V; Package Quantity: 1; Min Operating Temperature: -55°C; Capacitance: 22uF; Halogen Free: Halogen Free; Case Code (Metric): 3225; Mount: Surface Mount; Construction: Flat; Radiation Hardening: No; Length: 3.2mm; Voltage Rating (DC): 25V; Contact Plating: Nickel; Number of Pins: 2; Dielectric: X5R; RoHS Compliant: Yes; Resistor Type: Ceramic; Series: M
C189 = CMP-2000-07442-2: as C166 on sheet 18-Power-P3V3; Resistor Type: Ceramic; Width: 0.063inch; Case Code (Imperial): 1206; Radiation Hardening: No; Thickness: 0.071inch; Dielectric: X5R; Weight: 0.000571oz; Termination: SMD/SMT; Dielectric Material: Ceramic; Min Operating Temperature: -55°C; Depth: 1.6mm; Case Code (Metric): 3216; Max Operating Temperature: 85°C; RoHS Compliant: Yes; REACH SVHC: No SVHC; Mount: Surface Mount; Lead Free: Lead Free; Height: 1.6mm; Length: 3.2mm; Tolerance: 20%; Voltage Rating (DC): 16V; Capacitance: 47uF; Package Quantity: 1; Construction: Flat; Packaging: Tape and Reel; Series: C; Case/Package: 1206; Voltage Rating: 16V
C190 = CMP-2000-06226-4: as C168 on sheet 18-Power-P3V3; Packaging: Tape and Reel; Construction: Flat; Height: 0.8mm; Max Operating Temperature: 85°C; Dielectric: X5R; Case Code (Metric): 1608; Voltage Rating (DC): 16V; Width: 0.031inch; Voltage Rating: 16V; Length: 0.063inch; RoHS Compliant: Yes; Halogen Free: Halogen Free; Case Code (Imperial): 0603; Capacitance: 10uF; Mount: Surface Mount; Thickness: 0.031inch; Tolerance: 20%; Min Operating Temperature: -55°C; Series: M; Termination: SMD/SMT; Case/Package: 0603; Package Quantity: 1
C191 = CMP-2000-05998-2: as C169 on sheet 18-Power-P3V3; REACH SVHC: No SVHC; Series: C; Termination: SMD/SMT; Case Code (Imperial): 0402; Depth: 0.5mm; Mount: Surface Mount; Width: 0.02inch; Package Quantity: 1; Dielectric Material: Ceramic; Length: 1mm; Packaging: Tape and Reel; Case Code (Metric): 1005; RoHS Compliant: Yes; Dielectric: X5R; Max Operating Temperature: 85°C; Lead Free: Lead Free; Weight: 2.3E-05oz; Thickness: 0.022inch; Voltage Rating (DC): 16V; Tolerance: 10%; Voltage Rating: 16V; Resistor Type: Ceramic; Height: 0.5mm; Case/Package: 0402; Min Operating Temperature: -55°C
C192 = CMP-14477-000104-2: as C177 on sheet 18-Power-P3V3; Packaging: Tape and Reel; Depth: 0.5mm; Mount: Surface Mount; Thickness: 0.022inch; Package Quantity: 1; Min Operating Temperature: -55°C; Series: M; Voltage Rating (DC): 16V; Termination: SMD/SMT; Case/Package: 0402; Number of Pins: 2; Case Code (Imperial): 0402; Length: 1mm; Halogen Free: Halogen Free; Case Code (Metric): 1005; Width: 0.02inch; RoHS Compliant: Yes; Radiation Hardening: No; Max Operating Temperature: 85°C; Height: 0.5mm; Construction: Flat
D19 = CMP-2000-05198-2: as D12 on sheet 18-Power-P3V3; Width: 0.8mm; Case Code (Imperial): 0603; Number of Pins: 2; Lead Free: Lead Free; Packaging: Tape and Reel; Package Quantity: 1; Min Operating Temperature: -55°C; Case/Package: 0603; Length: 1.6mm; Power Dissipation: 75mW; Depth: 0.8mm; Radiation Hardening: No; Mount: Surface Mount; Max Operating Temperature: 85°C; Color: Green; Power Rating: 75mW; Height: 0.55mm; Illumination Color: Green; Case Code (Metric): 1608; Lens Transparency: Clear; Number of Elements: 1
L22 = CMP-02424-000263-1: Commercial Inductors, High Saturation Series 3.3uH 10A 14.4mΩ 20%; Test Frequency: 100kHz; DC Resistance (DCR): 14.4mR; Shielding: Shielded; Max DC Current: 18.6A; Core Material: Metal; Self Resonant Frequency: 5MHz; Width: 0.405inch; RMS Current (Irms): 10A; Weight: 0.070548oz; Number of Pins: 4040; Height: 4mm; Tolerance: 20%; Contact Plating: Tin; Termination: SMD/SMT; Case Code (Imperial): 4040; Length: 0.43inch; Lead Free: Lead Free; Military Standard: Not; Depth: 10.3mm; Mount: Surface Mount; Radiation Hardening: No; Current Rating: 10A; Min Operating Temperature: -55°C; Height - Seated (Max): 0.157inch; Max Operating Temperature: 125°C; Inductance Tolerance: 20%; Packaging: Tape and Reel; Case/Package: 4040; Package Quantity: 500; Inductance: 3.3uH; Saturation Current: 18.6A
R173 = CMP-2002-06039-1: Part Number: MC00625W0402120K; Manufacturer: Multicomp
R174 = CMP-2002-07709-1: as R159 on sheet 18-Power-P3V3
R176 = CMP-2002-01054-1: Part Number: ERJ-2RKF7322X; Manufacturer: Panasonic
R185 = CMP-2002-00759-4: as R160 on sheet 18-Power-P3V3; Radiation Hardening: No; Case/Package: 0402; Case Code (Metric): 1005; Min Operating Temperature: -55°C; Termination: SMD/SMT; Package Quantity: 1; Length: 1mm; Case Code (Imperial): 0402; Lead Free: Lead Free; Height: 0.35mm; Max Operating Temperature: 155°C; Depth: 0.5mm; Number of Terminations: 2; Military Standard: Not; Max Power Dissipation: 100mW; Tolerance: 1%; Composition: Thick Film; Weight: 2.8E-05oz; Features: Automotive AEC-Q200; Voltage Rating: 50V; Contact Plating: Tin; REACH SVHC: No SVHC; Width: 0.02inch; Packaging: Cut Tape; Mount: Surface Mount
R191 R226 R251 = CMP-2000-07588-1: as R152 on sheet 17-FPGA-02b; RoHSCompliant: True; Lead Free: LeadFree; Package Quantity: 1; Contact Plating: Tin; Length: 1mm; Radiation Hardening: No; REACH SVHC: NoSVHC; Max Operating Temperature: 155degC; Depth: 0.5mm; Case Code (Imperial): 0402; Military Standard: Not; Package Description: 2-Pin Surface Mount Device, Body 1 x 0.5 mm; Termination: SMD/SMT; Case Code (Metric): 1005; Height: 0.35mm; Packaging: TapeandReel; Voltage Rating (DC): 50V; Package Reference: 402; Number of Pins: 2; Tolerance: 1%; Mounting Technology: SurfaceMount; Width: 0.02inch; Mount: SurfaceMount; Datasheet URL: https://industrial.panasonic.com/cdbs/www-data/pdf/RDA0000/AOA0000C304.pdf; Composition: ThickFilm; Datasheet Version: 02/2017; Manufacturer URL: http://www.panasonic.com/; Max Power Dissipation: 100mW; Number of Terminations: 2; Min Operating Temperature: -55degC
R227 = CMP-2000-07451-1: as R153 on sheet 17-FPGA-02b; Number of Terminations: 2; Mount: SurfaceMount; Height: 0.35mm; Packaging: TapeandReel; Contact Plating: Tin; Manufacturer URL: http://www.panasonic.com/; Composition: ThickFilm; Max Operating Temperature: 155degC; REACH SVHC: NoSVHC; Case/Package: 0402; Package Reference: 402; Depth: 0.5mm; Package Description: 2-Pin Surface Mount Device, Body 1 x 0.5 mm; Datasheet URL: https://industrial.panasonic.com/cdbs/www-data/pdf/RDA0000/AOA0000C301.pdf; RoHSCompliant: True; Case Code (Imperial): 0402; Military Standard: Not; Min Operating Temperature: -55degC; Power Rating: 100mW; Datasheet Version: 03/2015; Length: 1mm; Case Code (Metric): 1005; Termination: SMD/SMT; Mounting Technology: SurfaceMount; Voltage Rating: 50V; Width: 0.02inch; Package Quantity: 1; Lead Free: LeadFree; Radiation Hardening: No
R252 = CMP-2002-00757-2: as R155 on sheet 18-Power-P3V3; RoHS Compliant: Yes; Packaging: Tape and Reel; Case Code (Metric): 1005; Package Quantity: 1; Contact Plating: Tin; Series: ERJ; Mount: Surface Mount; Lead Free: Lead Free; Min Operating Temperature: -55°C; Number of Terminations: 2; Max Power Dissipation: 100mW; Technology: THICK FILM; Voltage Rating: 50V; Case/Package: 0402; Width: 0.02inch; Termination: SMD/SMT; Military Standard: Not; Height: 0.35mm; Radiation Hardening: No; Resistance Tolerance: 1%; Length: 1mm; REACH SVHC: No SVHC; Construction: Rectangular; Depth: 0.5mm; Features: Automotive AEC-Q200; Resistor Type: Thick Film; Case Code (Imperial): 0402; Tolerance: 1%; Size Code: 0402; Max Operating Temperature: 155°C
U29 = CMP-04918-000008-1: as U28 on sheet 18-Power-P3V3; Automotive: No; Manufacturer Part Number: TPS56637RPAR; Lead Free: Yes; Temperature Range Low: -40°C; Digikey Description: IC POWER MANAGEMENT; Octopart: https://octopart.com/tps56637rpar-texas+instruments-97650653; Temperature: -40°C to +150°C; Device Class L3: Voltage Regulators - Switching; Temperature Range High: +150°C; Package: RPA0010A; Device Class L2: Power Management ICs; ComponentLink2URL: http://www.ti.com/lit/ds/symlink/tps56637.pdf; Device Class L1: Integrated Circuits (ICs); RoHS: TRUE; ComponentLink2Description: Datasheet; Height: 1mm; Category: IC